# EAGLE design UserInterfaceBoard (EAGLE 5.11)

## Sheet 1 of 2
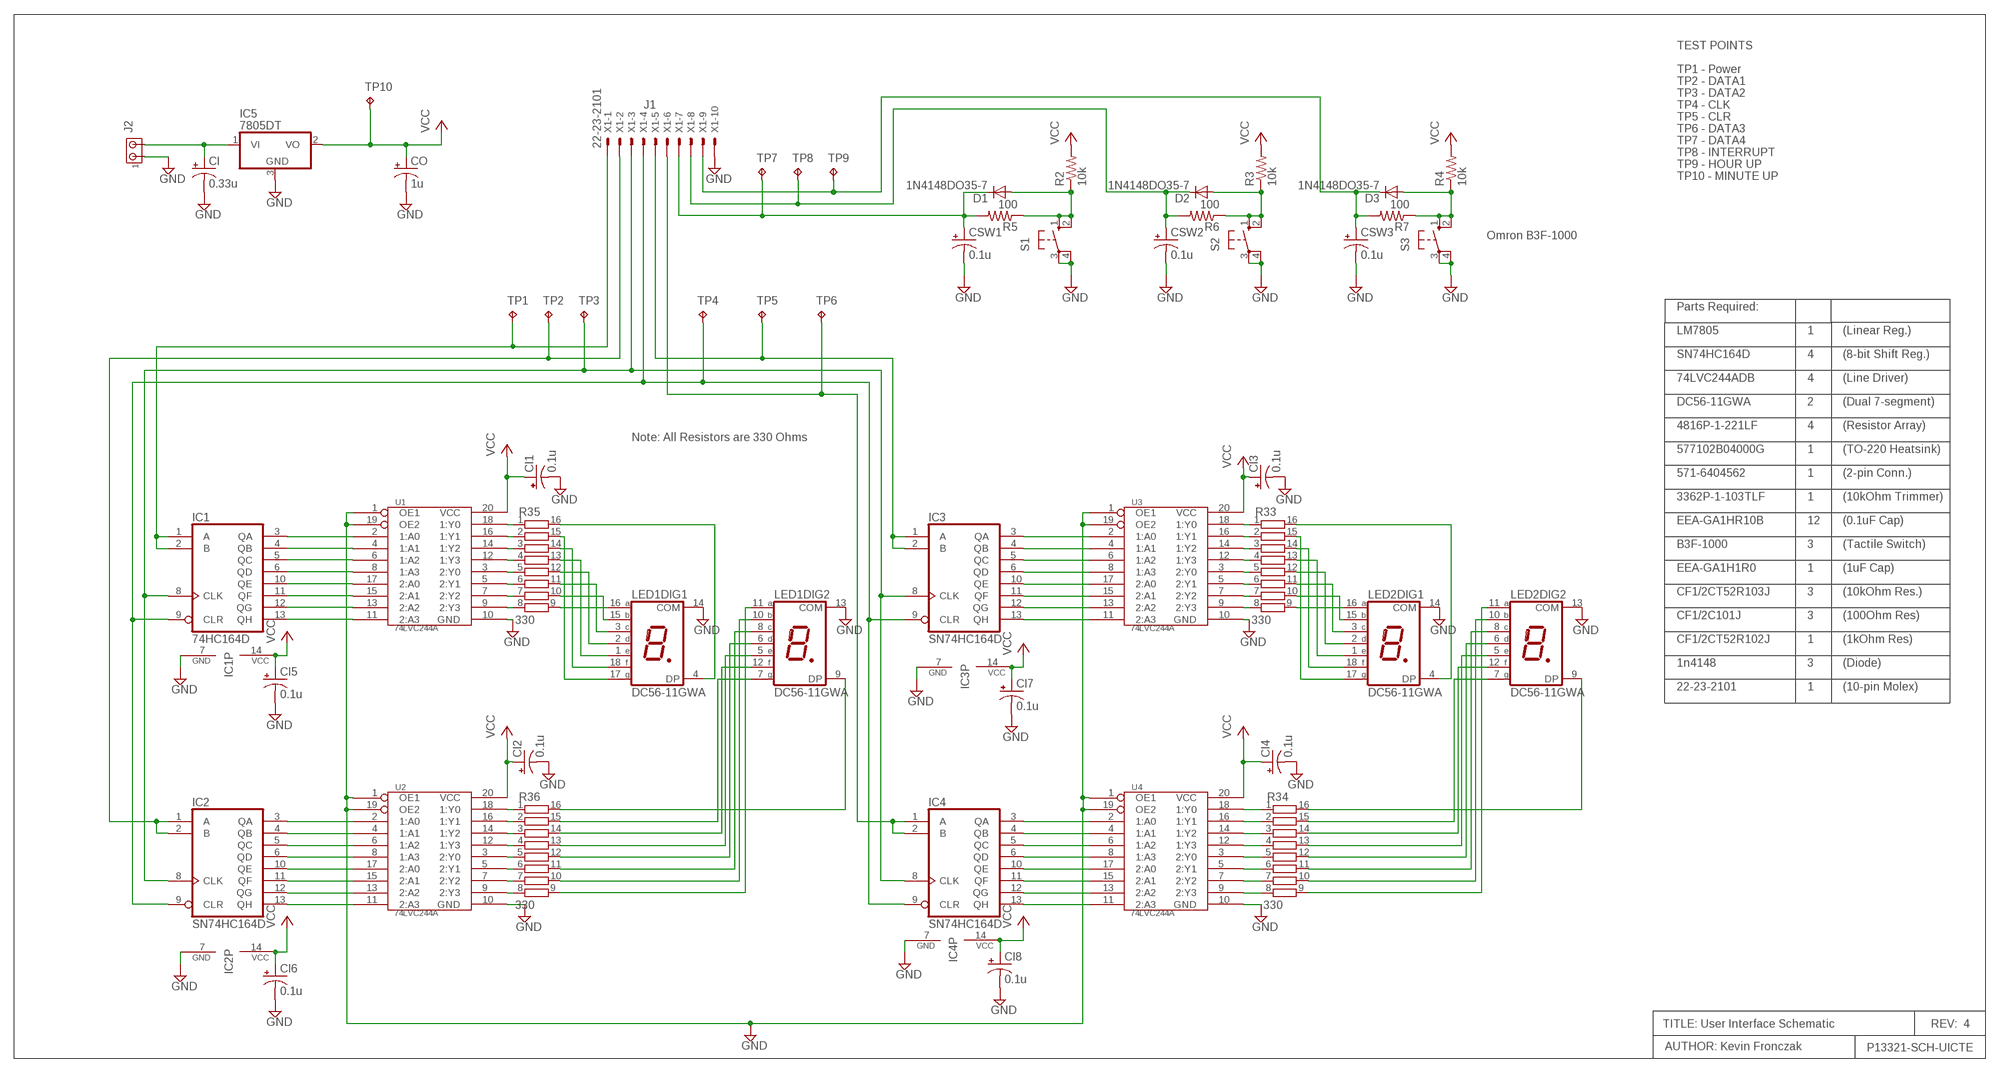
[diagram p0: schematic, sheet 1]

### Parts
CI  0.33u  CPOL-USE2-5  [E2-5]
CI1  0.1u  CPOL-USE2-5  [E2-5]
CI2  0.1u  CPOL-USE2-5  [E2-5]
CI3  0.1u  CPOL-USE2-5  [E2-5]
CI4  0.1u  CPOL-USE2-5  [E2-5]
CI5  0.1u  CPOL-USE2-5  [E2-5]
CI6  0.1u  CPOL-USE2-5  [E2-5]
CI7  0.1u  CPOL-USE2-5  [E2-5]
CI8  0.1u  CPOL-USE2-5  [E2-5]
CO  1u  CPOL-USE2-5  [E2-5]
CSW1  0.1u  CPOL-USE2-5  [E2-5]
CSW2  0.1u  CPOL-USE2-5  [E2-5]
CSW3  0.1u  CPOL-USE2-5  [E2-5]
D1  1N4148DO35-7  [DO35-7]
D2  1N4148DO35-7  [DO35-7]
D3  1N4148DO35-7  [DO35-7]
IC1  74HC164D  [SO14]
IC2  SN74HC164D  74164D  [SO14]
IC3  SN74HC164D  74164D  [SO14]
IC4  SN74HC164D  74164D  [SO14]
IC5  7805DT  [TO252]
J2  MTA02-100  [10X02MTA]
LED1  DC56-11GWA  [DA56]
LED2  DC56-11GWA  [DA56]
R2  10k  R-US_0207/10  [0207/10]
R3  10k  R-US_0207/10  [0207/10]
R4  10k  R-US_0207/10  [0207/10]
R5  100  R-US_0207/10  [0207/10]
R6  100  R-US_0207/10  [0207/10]
R7  100  R-US_0207/10  [0207/10]
R33  330  4816P-T01  [4816P]
R34  330  4816P-T01  [4816P]
R35  330  4816P-T01  [4816P]
R36  330  4816P-T01  [4816P]
S1  10-XX  [B3F-10XX]
S2  10-XX  [B3F-10XX]
S3  10-XX  [B3F-10XX]
TP1  TPPAD1-13  [P1-13]
TP2  TPPAD1-13  [P1-13]
TP3  TPPAD1-13  [P1-13]
TP4  TPPAD1-13  [P1-13]
TP5  TPPAD1-13  [P1-13]
TP6  TPPAD1-13  [P1-13]
TP7  TPPAD1-13  [P1-13]
TP8  TPPAD1-13  [P1-13]
TP9  TPPAD1-13  [P1-13]
TP10  TPPAD1-13  [P1-13]
U1  74LVC244A  [SO20W]
U2  74LVC244A  [SO20W]
U3  74LVC244A  [SO20W]
U4  74LVC244A  [SO20W]
X1  22-23-2101  [22-23-2101]

### Nets
GND: CI1.- CI2.- CI3.- CI4.- CI5.- CI6.- CI7.- CI8.- CI.- CO.- CSW1.- CSW2.- CSW3.- IC1.7(GND) IC2.7(GND) IC3.7(GND) IC4.7(GND) IC5.3(GND) LED1.13(DIG2:COM) LED1.14(DIG1:COM) LED2.13(DIG2:COM) LED2.14(DIG1:COM) S1.3(P) S1.4(P1) S2.3(P) S2.4(P1) S3.3(P) S3.4(P1) U1.1(OE1) U1.10(GND) U1.19(OE2) U2.1(OE1) U2.10(GND) U2.19(OE2) U3.1(OE1) U3.10(GND) U3.19(OE2) U4.1(OE1) U4.10(GND) U4.19(OE2) X1.10
N$1: IC1.3(QA) U1.2(1:A0)
N$2: IC1.4(QB) U1.4(1:A1)
N$3: IC1.5(QC) U1.6(1:A2)
N$4: IC1.6(QD) U1.8(1:A3)
N$5: IC1.10(QE) U1.17(2:A0)
N$6: IC1.11(QF) U1.15(2:A1)
N$7: IC1.12(QG) U1.13(2:A2)
N$8: IC1.13(QH) U1.11(2:A3)
N$9: R35.1 U1.18(1:Y0)
N$10: LED1.15(DIG1:B) R35.10
N$11: LED1.3(DIG1:C) R35.11
N$12: LED1.2(DIG1:D) R35.12
N$13: LED1.1(DIG1:E) R35.13
N$14: LED1.18(DIG1:F) R35.14
N$15: LED1.17(DIG1:G) R35.15
N$16: LED1.4(DIG1:DP) R35.16
N$17: IC2.3(QA) U2.2(1:A0)
N$18: IC2.4(QB) U2.4(1:A1)
N$19: IC2.5(QC) U2.6(1:A2)
N$20: IC2.6(QD) U2.8(1:A3)
N$21: IC2.10(QE) U2.17(2:A0)
N$22: IC2.11(QF) U2.15(2:A1)
N$23: IC2.12(QG) U2.13(2:A2)
N$24: IC2.13(QH) U2.11(2:A3)
N$26: R35.2 U1.16(1:Y1)
N$27: IC1.1(A) IC1.2(B) TP1.TP X1.1
N$28: R35.3 U1.14(1:Y2)
N$29: R35.4 U1.12(1:Y3)
N$30: R35.5 U1.3(2:Y0)
N$31: R35.6 U1.5(2:Y1)
N$32: R35.7 U1.7(2:Y2)
N$33: R35.8 U1.9(2:Y3)
N$34: LED1.16(DIG1:A) R35.9
N$35: IC1.8(CLK) IC2.8(CLK) IC3.8(CLK) IC4.8(CLK) TP3.TP X1.3
N$36: IC1.9(CLR) IC2.9(CLR) IC3.9(CLR) IC4.9(CLR) TP4.TP X1.4
N$37: LED2.15(DIG1:B) R33.10
N$38: LED2.3(DIG1:C) R33.11
N$39: LED2.2(DIG1:D) R33.12
N$40: LED2.1(DIG1:E) R33.13
N$41: LED2.18(DIG1:F) R33.14
N$42: LED2.17(DIG1:G) R33.15
N$43: R33.2 U3.16(1:Y1)
N$44: LED2.11(DIG2:A) R34.9
N$45: LED2.10(DIG2:B) R34.10
N$46: LED2.8(DIG2:C) R34.11
N$47: LED2.6(DIG2:D) R34.12
N$48: LED2.5(DIG2:E) R34.13
N$49: LED2.12(DIG2:F) R34.14
N$50: LED2.7(DIG2:G) R34.15
N$51: LED2.9(DIG2:DP) R34.16
N$52: R33.1 U3.18(1:Y0)
N$53: IC3.3(QA) U3.2(1:A0)
N$54: IC3.4(QB) U3.4(1:A1)
N$55: IC3.5(QC) U3.6(1:A2)
N$56: IC3.6(QD) U3.8(1:A3)
N$57: IC3.10(QE) U3.17(2:A0)
N$58: IC3.11(QF) U3.15(2:A1)
N$59: IC3.12(QG) U3.13(2:A2)
N$60: IC3.13(QH) U3.11(2:A3)
N$61: IC4.3(QA) U4.2(1:A0)
N$62: IC4.4(QB) U4.4(1:A1)
N$63: IC4.5(QC) U4.6(1:A2)
N$64: IC4.6(QD) U4.8(1:A3)
N$65: IC4.10(QE) U4.17(2:A0)
N$66: IC4.11(QF) U4.15(2:A1)
N$67: IC4.12(QG) U4.13(2:A2)
N$68: IC4.13(QH) U4.11(2:A3)
N$69: LED2.4(DIG1:DP) R33.16
N$70: IC3.1(A) IC3.2(B) TP5.TP X1.5
N$71: LED2.16(DIG1:A) R33.9
N$72: D1.A R2.1 R5.1 S1.1(S) S1.2(S1)
N$73: IC2.1(A) IC2.2(B) TP2.TP X1.2
N$74: IC4.1(A) IC4.2(B) TP6.TP X1.6
N$75: R33.3 U3.14(1:Y2)
N$76: R33.4 U3.12(1:Y3)
N$77: R33.5 U3.3(2:Y0)
N$78: R33.6 U3.5(2:Y1)
N$79: R33.7 U3.7(2:Y2)
N$80: R33.8 U3.9(2:Y3)
N$81: R34.2 U4.16(1:Y1)
N$82: R34.1 U4.18(1:Y0)
N$83: R34.3 U4.14(1:Y2)
N$84: R34.4 U4.12(1:Y3)
N$85: R34.5 U4.3(2:Y0)
N$86: R34.6 U4.5(2:Y1)
N$87: R34.7 U4.7(2:Y2)
N$88: R34.8 U4.9(2:Y3)
N$89: LED1.11(DIG2:A) R36.9
N$90: LED1.10(DIG2:B) R36.10
N$91: LED1.8(DIG2:C) R36.11
N$92: LED1.6(DIG2:D) R36.12
N$93: LED1.5(DIG2:E) R36.13
N$94: LED1.12(DIG2:F) R36.14
N$95: LED1.7(DIG2:G) R36.15
N$96: LED1.9(DIG2:DP) R36.16
N$97: R36.1 U2.18(1:Y0)
N$98: R36.2 U2.16(1:Y1)
N$99: R36.3 U2.14(1:Y2)
N$100: R36.4 U2.12(1:Y3)
N$101: R36.5 U2.3(2:Y0)
N$102: R36.6 U2.5(2:Y1)
N$103: R36.7 U2.7(2:Y2)
N$104: R36.8 U2.9(2:Y3)
N$105: CI.+ IC5.1(VI) J2.2
N$107: D2.A R3.1 R6.1 S2.1(S) S2.2(S1)
N$110: D3.A R4.1 R7.1 S3.1(S) S3.2(S1)
N$111: CSW1.+ D1.C R5.2 TP7.TP X1.7
N$112: CSW2.+ D2.C R6.2 TP8.TP X1.8
N$113: CSW3.+ D3.C R7.2 TP9.TP X1.9
VCC: CI1.+ CI2.+ CI3.+ CI4.+ CI5.+ CI6.+ CI7.+ CI8.+ CO.+ IC1.14(VCC) IC2.14(VCC) IC3.14(VCC) IC4.14(VCC) IC5.2(VO) R2.2 R3.2 R4.2 TP10.TP U1.20(VCC) U2.20(VCC) U3.20(VCC) U4.20(VCC)
Unconnected: J2.1

### Notes on the sheet
- TEST POINTS
- TP1 - Power
- TP2 - DATA1
- TP3 - DATA2
- J1 | TP4 - CLK
- TP5 - CLR
- TP6 - DATA3
- TP7 - DATA4
- TP8 - INTERRUPT
- TP9 - HOUR UP
- TP10 - MINUTE UP
- Omron B3F-1000
- Parts Required:
- LM7805 | 1 | (Linear Reg.)
- SN74HC164D | 4 | (8-bit Shift Reg.)
- 74LVC244ADB | 4 | (Line Driver)
- DC56-11GWA | 2 | (Dual 7-segment)
- 4816P-1-221LF | 4 | (Resistor Array)
- Note: All Resistors are 330 Ohms
- 577102B04000G | 1 | (TO-220 Heatsink)
- 571-6404562 | 1 | (2-pin Conn.)
- 3362P-1-103TLF | 1 | (10kOhm Trimmer)
- EEA-GA1HR10B | 12 | (0.1uF Cap)
- B3F-1000 | 3 | (Tactile Switch)
- EEA-GA1H1R0 | 1 | (1uF Cap)
- CF1/2CT52R103J | 3 | (10kOhm Res.)
- CF1/2C101J | 3 | (100Ohm Res)
- CF1/2CT52R102J | 1 | (1kOhm Res)
- 1n4148 | 3 | (Diode)
- 22-23-2101 | 1 | (10-pin Molex)
- TITLE: User Interface Schematic | REV:  4
- AUTHOR: Kevin Fronczak | P13321-SCH-UICTE

## Sheet 2 of 2

## Library data of the parts
CI CI1-CI8 CO CSW1-CSW3 = rcl:CPOL-US: POLARIZED CAPACITOR, American symbol
D1-D3 = diode:1N4148: DIODE high speed (Philips)
IC1-IC4 = 74xx-us:74*164: 8-bit parallel out SHIFT REGISTER
IC5 = linear:78*: Positive VOLTAGE REGULATOR Source: http://cache.national.com/ds/LM/LM78L05.pdf http://www.fairchildsemi.com/ds/LM/LM7805.pdf
J2 = con-amp:MTA02-100: AMP connector; OC_FARNELL: unknown; OC_NEWARK: unknown
LED1 LED2 = display-kingbright:DC56-11: 14.22mm (0.56INCH) DUAL DIGIT NUMERIC DISPLAYS Source: www.kingbright.com .. DA56-11SRWA.pdf; OC_FARNELL: unknown; OC_NEWARK: unknown
R2-R7 = rcl:R-US_: RESISTOR, American symbol
R33-R36 = resistor-bourns:4816P-T01: BOURNS RESISTOR NETWORK; MF: BOURNS, INC.; MPN: 4816P-T01-684LF; OC_FARNELL: 9357483; OC_NEWARK: 33K0707
S1-S3 = switch-omron:10-XX: OMRON SWITCH; MPN: B3F-1000; OC_FARNELL: 176432; OC_NEWARK: 36M3542
TP1-TP10 = testpad:TP: Test pad
U1-U4 = 74xx-us:74LVC244A: Octal buffer/line driver; 3-state; non-inverting
X1 = con-molex:22-23-2101: .100" (2.54mm) Center Header - 10 Pin; MF: MOLEX; MPN: 22-23-2101; OC_FARNELL: 1756828; OC_NEWARK: 94C0765

## Board
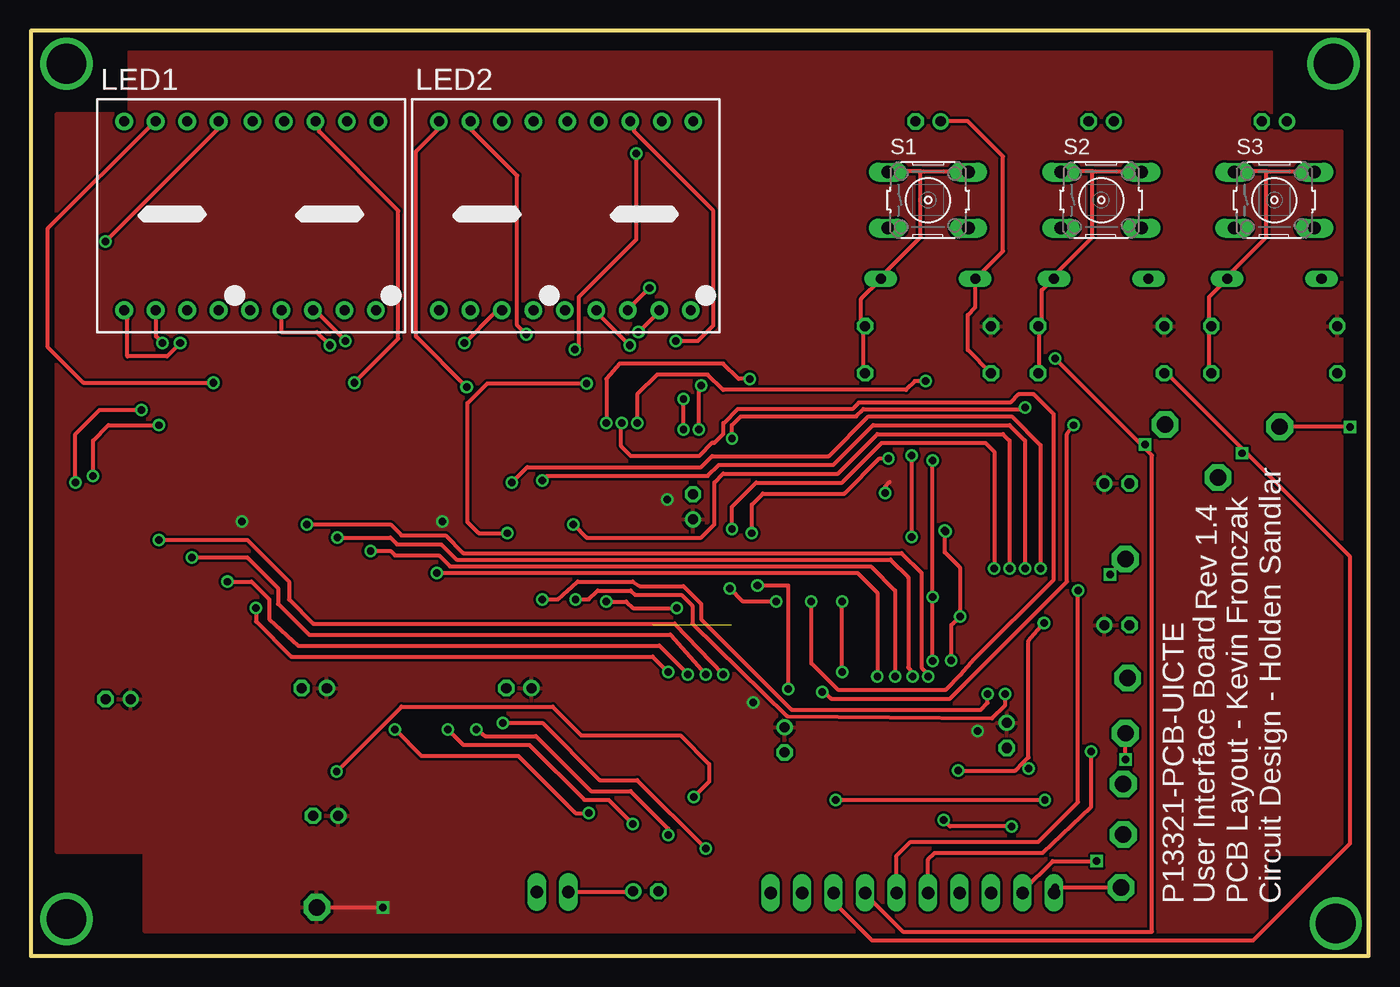
[diagram p1: board, top side]
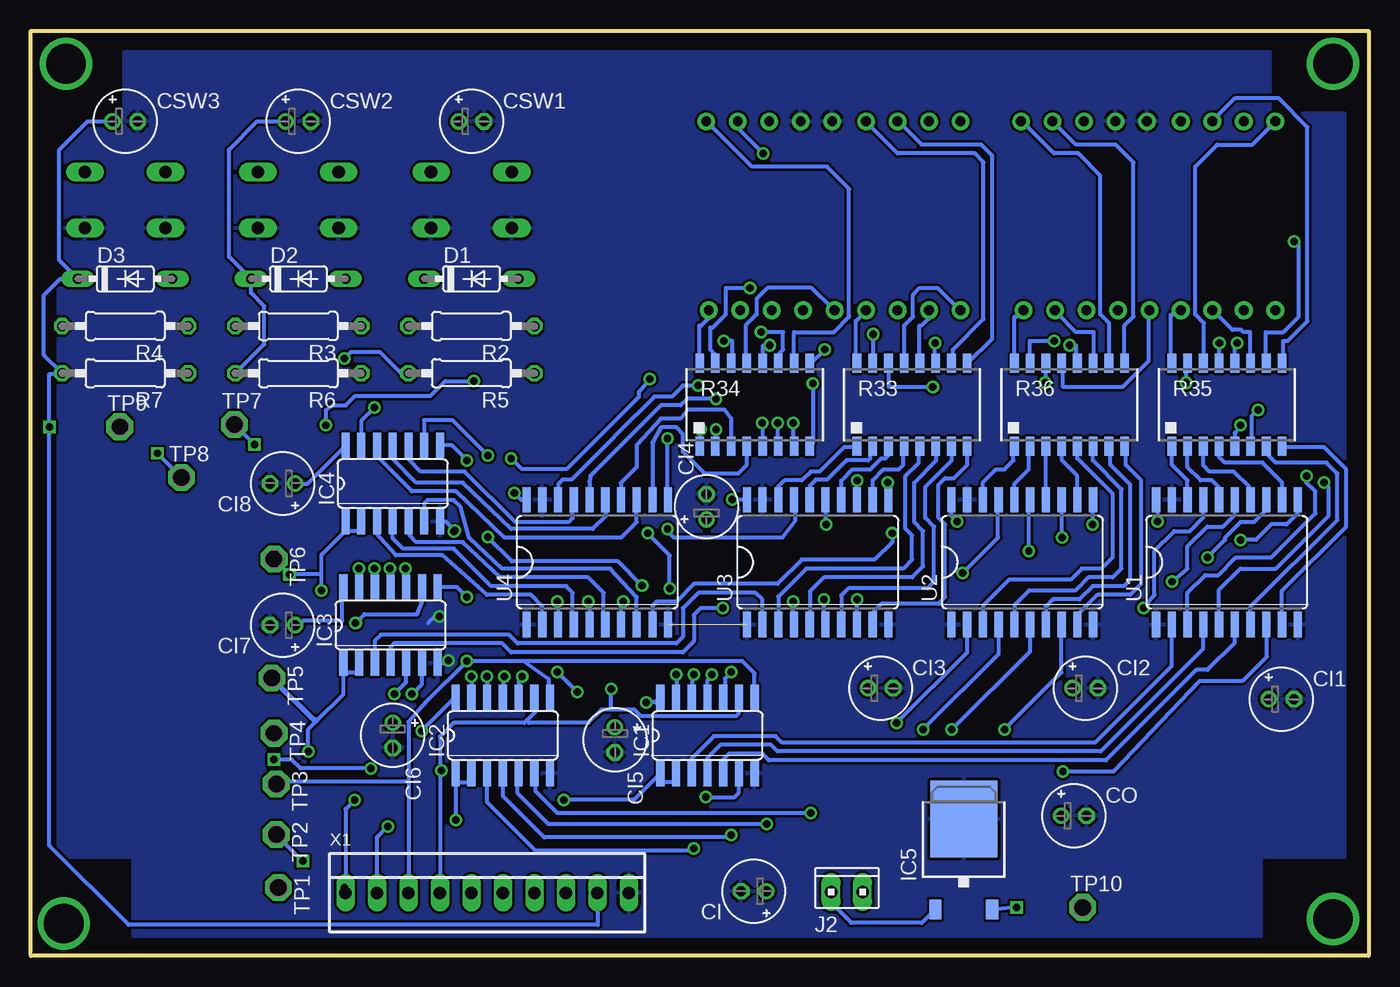
[diagram p2: board, bottom side, seen from below]

Size 107.93 x 74.6 mm. Coordinates in mm from the lower left corner, seen from the top.
Outline: 0,0 107.93,0 107.93,74.6 0,74.6 0,0
Copper layers (1*16): Top 0.035mm / dielectric 1.5mm / Bottom 0.035mm
Design rules "default *": minimum track width 12mil, minimum drill 24mil, track to track 8mil, track to pad 8mil, pad to pad 8mil, via to via 8mil, smd to smd 8mil, copper to edge 40mil, drill to drill 8mil, minimum pad ring 10mil, minimum via ring 8mil, stop-mask expansion 4mil, vias tented up to drill 0mil, thermal gap 10mil

### Footprints (pad centres in the part's own frame; a part is rotated, then mirrored left to right if it is on the bottom)
E2-5 = drill 0.813 pad 1.27 round: + -1.016,0 | drill 0.813 pad 1.27 octagon: - 1.016,0
DO35-7 = drill 0.813 long: A 3.81,0; C -3.81,0
SO14 = smd 0.66 x 2.032: 1 -3.81,-3.073; 2 -2.54,-3.073; 3 -1.27,-3.073; 4 0,-3.073; 5 1.27,-3.073; 6 2.54,-3.073; 7 3.81,-3.073; 8 3.81,3.073; 9 2.54,3.073; 10 1.27,3.073; 11 0,3.073; 12 -1.27,3.073; 13 -2.54,3.073; 14 -3.81,3.073
TO252 = smd 1 x 1.6: 1 -2.28,-4.8; 2 2.28,-4.8 | smd 5.4 x 6.2: 3 0,2.5
10X02MTA = drill 1.016 long: 1 1.27,0; 2 -1.27,0
DA56 = drill 0.8 pad 1.422 round: 1 -10.26,-7.62; 2 -7.72,-7.62; 3 -5.18,-7.62; 4 -2.64,-7.62; 5 -0.1,-7.62; 6 2.44,-7.62; 7 4.98,-7.62; 8 7.52,-7.62; 9 10.06,-7.62; 10 10.26,7.62; 11 7.72,7.62; 12 5.18,7.62; 13 2.64,7.62; 14 0.1,7.62; 15 -2.64,7.62; 16 -5.18,7.62; 17 -7.72,7.62; 18 -10.26,7.62
0207/10 = drill 0.813 octagon: 1 -5.08,0; 2 5.08,0
4816P = smd 0.7 x 1.5: 1 -4.445,-3.346; 2 -3.175,-3.346; 3 -1.905,-3.346; 4 -0.635,-3.346; 5 0.635,-3.346; 6 1.905,-3.346; 7 3.175,-3.346; 8 4.445,-3.346; 9 4.445,3.346; 10 3.175,3.346; 11 1.905,3.346; 12 0.635,3.346; 13 -0.635,3.346; 14 -1.905,3.346; 15 -3.175,3.346; 16 -4.445,3.346
B3F-10XX = drill 1.016 long: 1 -3.251,2.261; 2 3.251,2.261; 3 -3.251,-2.261; 4 3.251,-2.261
P1-13 = drill 1.321 pad 2.159 octagon: TP 0,0
SO20W = smd 0.66 x 2.032: 1 -5.715,-5.029; 2 -4.445,-5.029; 3 -3.175,-5.029; 4 -1.905,-5.029; 5 -0.635,-5.029; 6 0.635,-5.029; 7 1.905,-5.029; 8 3.175,-5.029; 9 4.445,-5.029; 10 5.715,-5.029; 11 5.715,5.029; 12 4.445,5.029; 13 3.175,5.029; 14 1.905,5.029; 15 0.635,5.029; 16 -0.635,5.029; 17 -1.905,5.029; 18 -3.175,5.029; 19 -4.445,5.029; 20 -5.715,5.029
22-23-2101 = drill 1 long: 1 -11.43,0; 2 -8.89,0; 3 -6.35,0; 4 -3.81,0; 5 -1.27,0; 6 1.27,0; 7 3.81,0; 8 6.35,0; 9 8.89,0; 10 11.43,0

### Placement (x,y rotation side)
CI  49.61,5.21 180 bottom
CI1  7.04,20.7 0 bottom
CI2  22.86,21.59 0 bottom
CI3  39.37,21.59 0 bottom
CI4  53.42,36.22 90 bottom
CI5  60.81,17.42 270 bottom
CI6  78.74,17.78 270 bottom
CI7  87.63,26.67 180 bottom
CI8  87.63,38.1 180 bottom
CO  23.77,11.3 0 bottom
CSW1  72.39,67.31 0 bottom
CSW2  86.36,67.31 0 bottom
CSW3  100.33,67.31 0 bottom
D1  72.39,54.61 0 bottom
D2  86.36,54.61 0 bottom
D3  100.33,54.61 0 bottom
IC1  53.34,17.78 0 bottom
IC2  69.85,17.78 0 bottom
IC3  78.92,26.67 0 bottom
IC4  78.74,38.1 0 bottom
IC5  32.66,8.53 0 bottom
J2  42.09,5.16 0 bottom
LED1  17.78,59.69 0 top
LED2  43.18,59.69 0 top
R2  72.39,50.8 180 bottom
R3  86.36,50.8 180 bottom
R4  100.33,50.8 180 bottom
R5  72.39,46.99 180 bottom
R6  86.36,46.99 180 bottom
R7  100.33,46.99 180 bottom
R33  36.83,44.45 0 bottom
R34  49.53,44.45 0 bottom
R35  11.43,44.45 0 bottom
R36  24.13,44.45 0 bottom
S1  72.39,60.96 0 top
S2  86.36,60.96 0 top
S3  100.33,60.96 0 top
TP1  87.96,5.51 270 bottom
TP2  88.14,9.78 270 bottom
TP3  88.14,13.87 270 bottom
TP4  88.32,17.96 270 bottom
TP5  88.49,22.4 270 bottom
TP6  88.32,32 270 bottom
TP7  91.52,42.85 0 bottom
TP8  95.78,38.58 0 bottom
TP9  100.76,42.67 0 bottom
TP10  23.06,3.91 0 bottom
U1  11.43,31.75 0 bottom
U2  27.94,31.75 0 bottom
U3  44.45,31.75 0 bottom
U4  62.23,31.75 0 bottom
X1  71.12,5.08 0 bottom

### Tracks (layer width: path | path; a pad name or v marks a point on that pad's centre or on a via)
GND  (via drill 0.6)  (1 unrouted)
  Top 0.305: v73.74,34.31 73.74,32.54 74.98,31.29 v74.98,27.38 74.27,26.67 v74.27,23.82
  Bottom 0.305: IC2.7 66.17,14.71 | IC4.7 74.45,35.03 v73.74,34.31 | v74.98,27.38 75.34,27.38 75.87,26.85 | IC3.7 74.5,23.6 v74.27,23.82
  pour Bottom: 1.91,67.92 7.95,67.92 7.95,72.9 100.41,72.9 100.41,66.67 105.74,66.67 105.74,8 99.87,8 99.7,8 99.7,1.6 8.66,1.6 8.66,8 1.91,8 1.91,8.53
N$1
  Bottom 0.305: IC1.3 54.61,15.95 52.83,17.73 47.85,17.73 47.32,17.2 22.07,17.2 15.88,23.39 U1.2
N$2
  Bottom 0.305: U1.4 13.34,24.77 21.62,16.48 47.68,16.48 48.21,17.02 52.3,17.02 53.34,15.98 IC1.4
N$3
  Bottom 0.305: IC1.5 52.07,15.82 51.59,16.31 48.92,16.31 48.39,15.77 21.18,15.77 13.89,23.06 13.01,23.06 10.8,25.27 U1.6
N$4  (via drill 0.6)
  Top 0.305: v53.47,12.8 54.71,14.05 54.71,15.47 52.4,17.78 44.4,17.78 42.09,20.09 29.9,20.09 v24.66,14.86
  Bottom 0.305: U1.8 8.2,26.67 8.2,24.13 10.19,22.15 13.64,22.15 20.57,14.86 v24.66,14.86 | IC1.6 50.8,13.16 51.16,12.8 v53.47,12.8
N$5  (via drill 0.6 pad 0.25)
  Top 0.305: v51.41,22.89 50.17,24.13 21.01,24.13 18.16,26.98 v18.16,28.04
  Bottom 0.305: 51.94,21.08 IC1.10 51.94,20.98 51.94,22.35 v51.41,22.89 | v18.16,28.04 17.27,29.11 17.27,32.66 15.67,34.27 14.43,34.27 13.34,35.36 U1.17
N$6  (via drill 0.6 pad 0.25)
  Top 0.305: v53.01,22.71 50.7,25.02 21.54,25.02 19.23,27.15 19.23,28.75 17.81,30.18 v15.85,30.18
  Bottom 0.305: v15.85,30.18 14.61,31.24 14.61,33.02 13.01,34.62 11.76,34.62 10.8,35.59 U1.15 | v53.01,22.71 53.01,22.53 53.37,22.17 53.37,20.88 IC1.11
N$7  (via drill 0.6 pad 0.25)
  Top 0.305: v54.43,22.71 51.59,25.91 22.43,25.91 19.94,28.4 19.94,29.64 17.45,32.13 v13.01,32.13
  Bottom 0.305: v13.01,32.13 11.58,33.55 11.58,33.73 10.34,34.98 9.27,34.98 8.26,35.99 U1.13 | v54.43,22.71 54.61,22.53 IC1.12
N$8  (via drill 0.6 pad 0.25)
  Top 0.305: v55.85,22.71 51.94,26.8 22.78,26.8 20.83,28.75 20.83,30.18 17.45,33.55 v10.34,33.55
  Bottom 0.305: v10.34,33.55 9.09,33.55 7.85,34.8 6.6,34.8 5.72,35.69 U1.11 | v55.85,22.71 55.85,20.88 IC1.13
N$9
  Bottom 0.305: U1.18 14.61,38.35 15.88,39.62 R35.1
N$10  (via drill 0.61)
  Top 0.305: v5.99,57.61 15.24,66.85 15.24,67.21 LED1.15
  Bottom 0.305: v5.99,57.61 5.64,57.61 5.64,51.56 6.88,50.32 8.31,50.32 8.31,47.83 R35.10
N$11
  Bottom 0.305: R35.11 9.55,47.83 9.55,50.32 10.08,50.32 10.26,50.49 10.97,50.49 12.4,51.92 12.57,51.92 LED1.3
N$12  (via drill 0.61)
  Top 0.305: v10.62,49.43 10.08,49.96 10.08,51.92 LED1.2
  Bottom 0.305: v10.62,49.43 10.8,49.43 R35.12
N$13  (via drill 0.61)
  Top 0.305: v12.04,49.43 10.97,48.36 7.77,48.36 7.77,51.38 7.59,51.56 7.59,51.92 LED1.1
  Bottom 0.305: v12.04,49.43 12.04,47.83 R35.13
N$14
  Bottom 0.305: R35.14 13.28,47.83 13.28,51.03 14,51.74 14,63.65 12.22,65.43 9.37,65.43 7.59,67.21 LED1.18
N$15  (via drill 0.61)
  Top 0.305: LED1.17 9.91,67.21 1.37,58.67 1.37,49.07 4.22,46.23 v14.71,46.23
  Bottom 0.305: v14.71,46.23 14.71,47.65 R35.15
N$16
  Bottom 0.305: R35.16 15.95,47.83 15.95,51.74 15.77,51.74 15.6,51.92 15.24,51.92 LED1.4
N$17  (via drill 0.6, 0.6 pad 0.25)
  Top 0.305: v54.43,8.66 48.92,14.17 45.9,14.17 41.28,18.8 v38.07,18.8
  Bottom 0.305: IC2.3 71.12,12.37 67.23,8.48 54.61,8.48 v54.43,8.66 | v38.07,18.8 32.39,24.49 U2.2
N$18  (via drill 0.6, 0.6 pad 0.25)
  Top 0.305: v51.41,9.73 51.41,10.26 48.39,13.28 45.19,13.28 40.74,17.73 36.65,17.73 v35.94,18.26
  Bottom 0.305: v51.41,9.73 51.59,9.55 66.52,9.55 69.85,12.88 IC2.4 | v35.94,18.26 29.85,24.36 U2.4
N$19  (via drill 0.6, 0.6 pad 0.25)
  Top 0.305: v48.57,10.62 46.61,12.57 44.65,12.57 40.21,17.02 34.87,17.02 33.81,18.09 33.81,18.26 v33.63,18.26
  Bottom 0.305: IC2.5 68.66,14.63 68.66,13.11 66.17,10.62 v48.57,10.62 | v33.63,18.26 27.31,24.59 U2.6
N$20  (via drill 0.6, 0.6 pad 0.25)
  Top 0.305: v45.01,11.51 43.94,11.51 39.32,16.13 31.5,16.13 v29.36,18.26
  Bottom 0.305: IC2.6 67.23,13.28 65.46,11.51 v45.01,11.51 | v29.36,18.26 24.77,22.86 U2.8
N$21  (via drill 0.6)
  Top 0.305: v32.74,30.89 66.7,30.89 68.3,29.29 v68.3,22.53
  Bottom 0.305: IC2.10 68.58,22.25 v68.3,22.53 | v32.74,30.89 29.9,33.73 29.9,36.73 U2.17
N$22  (via drill 0.6)
  Top 0.305: v69.72,22.53 69.72,29.46 67.77,31.42 33.81,31.42 32.92,32.31 29.36,32.31 29.01,32.66 v27.41,32.66
  Bottom 0.305: IC2.11 69.85,22.4 v69.72,22.53 | v27.41,32.66 27.41,36.68 U2.15
N$23  (via drill 0.6)
  Top 0.305: v71.15,22.53 71.15,22.89 70.79,23.24 70.79,30.53 69.37,31.95 34.34,31.95 33.1,33.2 29.54,33.2 29.01,33.73 v24.74,33.73
  Bottom 0.305: IC2.12 71.12,22.5 v71.15,22.53 | v24.74,33.73 24.74,36.75 U2.13
N$24  (via drill 0.6)
  Top 0.305: v72.39,22.53 72.39,22.71 71.86,23.24 71.86,30.89 70.26,32.49 34.87,32.49 33.45,33.91 29.9,33.91 29.01,34.8 v22.25,34.8
  Bottom 0.305: v72.39,22.53 IC2.13 | v22.25,34.8 22.25,36.75 U2.11
N$25  (via drill 0.6)
  other vias: 51.41,9.73
N$26
  Bottom 0.305: U1.16 12.12,36.83 12.12,37.82 12.65,38.35 13.54,38.35 14.61,39.42 R35.2
N$27  (via drill 0.6)
  Top 0.305: v64.92,12.57 v81.81,12.57 | v82.63,5.51 TP1.TP
  Bottom 0.305: 55.88,15.24 IC1.2 55.85,14.68 55.85,13.99 57.1,13.99 57.15,14.05 IC1.1 59.28,12.57 v64.92,12.57 | v81.81,12.57 82.55,11.84 X1.1 v82.63,5.51
N$28
  Bottom 0.305: U1.14 9.63,36.88 9.63,37.82 10.87,39.06 12.83,39.06 13.34,39.57 R35.3
N$29
  Bottom 0.305: U1.12 6.96,36.8 6.96,38.18 8.56,39.78 11.58,39.78 12.07,40.26 R35.4
N$30  (via drill 0.6 pad 0.25)
  Top 0.305: v5,38.71 5,41.55 6.25,42.8 v10.34,42.8
  Bottom 0.305: U1.3 14.61,29.29 13.18,30.71 12.12,30.71 10.69,32.13 7.85,32.13 4.29,35.69 4.29,37.47 5,38.18 v5,38.71 | v10.34,42.8 10.69,42.27 10.8,42.19 R35.5
N$31  (via drill 0.6 pad 0.25)
  Top 0.305: v3.58,38.18 3.58,42.09 5.54,44.04 v8.92,44.04
  Bottom 0.305: U1.5 12.07,29.52 10.34,31.24 7.49,31.24 3.23,35.51 3.23,37.82 v3.58,38.18 | v8.92,44.04 9.45,43.51 9.45,41.2 | 9.45,41.2 9.45,41.18 R35.6 9.53,41.27 | 9.53,41.27 9.63,41.38 | 9.45,41.2 9.53,41.27
N$32
  Bottom 0.305: U1.7 9.53,28.14 2.51,35.15 2.51,38.89 3.4,39.78 7.49,39.78 8.26,40.54 R35.7
N$33
  Bottom 0.305: U1.9 6.99,29.44 1.8,34.62 1.8,39.24 3.58,41.02 6.9,41.02 R35.8
N$34
  Bottom 0.305: R35.9 6.88,47.83 6.88,49.61 6.53,49.61 4.93,51.21 4.93,66.85 7.24,69.16 10.8,69.16 12.57,67.39 LED1.16
N$35  (via drill 0.6)
  Top 0.305: v72.75,23.77 v72.75,28.93 v72.75,39.95 | v87.96,14.05 TP3.TP
  Bottom 0.305: 77.47,14.05 77.47,18.87 76.12,20.4 v72.75,23.77 68.12,23.77 | 77.47,14.05 X1.3 | 68.12,23.77 66.17,22.35 66.17,20.98 IC2.8 | IC1.8 49.53,22.78 50.52,23.77 68.12,23.77 | IC3.8 73.56,29.74 v72.75,28.93 | IC4.8 73.97,41.17 v72.75,39.95 | 77.47,14.05 v87.96,14.05
N$36  (via drill 0.6, 0.61)
  Top 0.305: v81.74,26.85 80.49,25.43 80.49,16 80.05,15.56 | 80.05,15.56 79.43,14.94 v74.8,14.94 | v71.07,33.78 v71.07,40.36 | v58.62,29.87 61.11,29.87 v61.11,21.51 | v88.32,15.82 TP4.TP | 80.05,15.56 v80.49,15.11
  Bottom 0.305: 74.93,14.94 74.93,17.68 73.81,18.8 68.12,18.8 67.95,18.97 | 74.93,14.94 X1.4 | 67.95,18.97 67.23,19.68 67.23,20.78 IC2.9 | IC1.9 50.8,19.58 51.05,19.33 58.7,19.33 59.23,19.86 61.11,19.86 | 61.11,19.86 61.9,19.86 62.97,18.8 67.77,18.8 67.95,18.97 | IC3.9 76.4,29.69 76.4,28.45 76.76,27.56 81.03,27.56 v81.74,26.85 | 74.93,14.94 v74.8,14.94 | v71.07,40.36 73.91,43.2 76.23,43.2 76.23,41.25 IC4.9 | v71.07,33.78 69.11,31.83 60.58,31.83 v58.62,29.87 | 61.11,19.86 v61.11,21.51 | v88.32,15.82 86.89,15.82 86.18,15.11 v80.49,15.11
N$37
  Bottom 0.305: R33.10 33.55,47.83 33.55,48.9 31.06,51.38 31.06,64.01 31.78,64.72 38,64.72 40.49,67.21 LED2.15
N$38  (via drill 0.61)
  Top 0.305: v34.98,49.43 37.47,51.92 38,51.92 LED2.3
  Bottom 0.305: v34.98,49.43 34.98,47.83 R33.11
N$39
  Bottom 0.305: R33.12 36.22,47.83 36.22,50.85 36.04,50.85 35.51,51.38 35.51,51.92 LED2.2
N$40
  Bottom 0.305: R33.13 37.47,50.85 36.75,51.56 36.75,53.34 36.22,53.87 34.8,53.87 33.02,52.09 LED2.1
N$41  (via drill 0.61)
  Top 0.305: v35.15,45.87 31.06,49.96 31.06,64.9 33.02,66.85 33.02,67.21 LED2.18
  Bottom 0.305: v35.15,45.87 38.71,45.87 38.71,47.65 R33.14
N$42  (via drill 0.61)
  Top 0.305: v39.95,50.14 39.24,50.85 39.24,62.94 35.33,66.85 35.33,67.21 LED2.17
  Bottom 0.305: v39.95,50.14 39.95,47.83 R33.15
N$43
  Bottom 0.305: U3.16 45.09,37.92 44.6,38.41 43.69,38.41 42.16,39.93 42.16,39.95 40.39,39.95 40.21,40.13 40.21,40.9 R33.2
N$44  (via drill 0.61)
  Top 0.305: v43.87,48.9 44.22,49.25 44.22,53.16 48.84,57.78 v48.84,64.72
  Bottom 0.305: v43.87,48.9 44.93,47.83 R34.9 | v48.84,64.72 50.8,66.67 50.8,67.21 LED2.11
N$45
  Bottom 0.305: R34.10 46.36,50.32 43.15,50.32 41.91,51.56 41.91,61.87 43.69,63.65 49.73,63.65 53.29,67.21 LED2.10
N$46  (via drill 0.61)
  Top 0.305: v49.02,50.32 50.62,51.92 LED2.8
  Bottom 0.305: v49.02,50.32 47.24,50.32 47.24,48.9 47.6,48.54 47.6,47.83 R34.11
N$47  (via drill 0.61)
  Top 0.305: v48.31,49.25 45.64,51.92 LED2.6
  Bottom 0.305: v48.31,49.25 48.84,49.25 48.84,47.83 R34.12
N$48
  Bottom 0.305: R34.13 50.27,47.83 50.27,50.85 49.38,51.74 49.38,52.98 48.49,53.87 44.93,53.87 43.15,52.09 LED2.5
N$49  (via drill 0.61)
  Top 0.305: LED2.12 48.49,67.21 48.49,66.85 48.67,66.67 48.67,66.5 55.07,60.1 55.07,50.85 53.82,49.61 v52.04,49.61
  Bottom 0.305: v52.04,49.61 51.33,49.61 51.33,47.83 R34.14
N$50  (via drill 0.61)
  Top 0.305: v49.91,53.87 48.31,52.27 48.31,52.09 LED2.7
  Bottom 0.305: v49.91,53.87 51.87,53.87 51.87,51.74 52.93,50.67 53.11,50.67 53.11,48.9 52.76,48.54 52.76,47.83 R34.15
N$51
  Bottom 0.305: R34.16 54,47.83 54,50.85 53.82,50.85 53.29,51.38 53.29,51.92 LED2.9
N$52
  Bottom 0.305: U3.18 47.63,37.87 47.14,38.35 45.72,38.35 45.01,39.06 44.3,39.06 42.34,41.02 41.36,41.02 R33.1
N$53
  Bottom 0.305: IC3.3 80.19,25.4 79.68,25.91 69.37,25.91 68.66,25.2 55.85,25.2 55.32,25.73 55.32,28.04 54.08,29.29 49.45,29.29 48.92,28.75 48.92,26.75 U3.2
N$54  (via drill 0.6)
  Top 0.305: v52.12,28.04 48.57,28.04 48.03,28.57 v46.43,28.57
  Bottom 0.305: IC3.4 78.92,24.89 78.61,25.2 69.9,25.2 69.19,24.49 55.32,24.49 54.43,25.38 54.43,27.51 53.9,28.04 v52.12,28.04 | v46.43,28.57 46.43,26.8 U3.4
N$55  (via drill 0.6)
  Top 0.305: v78.61,21.11 78.61,20.22 77.55,19.15 61.01,19.33 53.37,26.8 53.37,28.22 52.48,29.11 48.74,29.11 48.39,29.46 45.72,29.46 45.01,28.75 v43.94,28.75
  Bottom 0.305: IC3.5 77.65,22.07 v78.61,21.11 | v43.94,28.75 43.94,26.85 U3.6
N$56  (via drill 0.6)
  Top 0.305: v77.19,21.11 77.19,20.4 76.66,19.86 61.37,19.86 54.08,27.15 54.08,28.4 52.65,29.82 49.1,29.82 48.57,30.18 44.12,30.18 42.52,28.75 v41.28,28.75
  Bottom 0.305: IC3.6 76.38,21.92 v77.19,21.11 | U3.8 v41.28,28.75
N$57  (via drill 0.6)
  Top 0.305: v77.72,31.24 77.72,40.66 77.01,41.38 68.66,41.38 65.46,38.18 58.52,38.18 56.57,36.22 v56.57,34.44
  Bottom 0.305: IC3.10 77.65,31.17 v77.72,31.24 | v56.57,34.44 56.57,34.27 56.03,33.73 47.32,33.73 46.25,35.15 46.25,36.68 U3.17
N$58  (via drill 0.6)
  Top 0.305: v78.97,31.24 78.97,41.55 78.44,42.09 68.3,42.09 65.1,38.89 55.85,38.89 55.14,38.18 55.14,34.8 54.08,33.73 44.83,33.73 v43.76,34.8
  Bottom 0.305: IC3.11 78.92,31.19 v78.97,31.24 | v43.76,34.8 43.76,36.73 U3.15
N$59  (via drill 0.6)
  Top 0.305: v80.21,31.24 80.21,41.55 78.97,42.8 67.95,42.8 64.74,39.6 55.5,39.6 54.61,38.71 41.63,38.71 v41.28,38.35
  Bottom 0.305: IC3.12 80.19,31.22 v80.21,31.24 | U3.13 v41.28,38.35
N$60  (via drill 0.6)
  Top 0.305: v81.46,31.24 81.46,41.2 79.15,43.51 67.59,43.51 64.39,40.31 54.97,40.31 54.08,39.42 40.03,39.42 v38.79,38.18
  Bottom 0.305: v81.46,31.24 IC3.13 | v38.79,38.18 38.79,36.83 U3.11
N$61
  Bottom 0.305: U4.2 66.68,28.19 67.59,29.11 71.15,29.11 74.7,32.31 78.49,32.31 80.14,34.14 80.14,34.9 IC4.3 79.86,34.87
N$62
  Bottom 0.305: IC4.4 78.74,33.68 77.9,32.84 73.81,32.84 70.79,29.82 64.74,29.82 64.21,29.29 64.21,26.8 U4.4
N$63
  Bottom 0.305: IC4.5 77.42,35.03 77.37,34.98 77.37,33.91 76.84,33.38 73.1,33.38 70.08,30.53 62.97,30.53 61.72,29.29 61.72,26.85 U4.6
N$64
  Bottom 0.305: IC4.6 76.2,36.5 75.95,36.75 73.81,36.75 73.28,36.22 72.57,33.73 69.9,31.24 61.19,31.24 59.06,28.93 U4.8
N$65
  Bottom 0.305: IC4.10 77.47,40.06 76.48,39.06 72.92,39.06 68.83,34.98 64.57,34.98 64.21,35.33 64.21,36.7 U4.17
N$66
  Bottom 0.305: IC4.11 78.74,40.08 76.84,38.18 73.1,38.18 69.19,34.44 62.61,34.44 61.54,35.51 61.54,36.73 U4.15
N$67
  Bottom 0.305: IC4.12 80.01,40.28 77.19,37.47 73.63,37.47 69.72,33.73 60.3,33.73 59.06,34.98 U4.13
N$68  (via drill 0.6)
  Top 0.305: v56.57,41.73 56.57,42.8 57.28,43.51 66.57,43.51 67.16,44.09 80.09,44.09 v80.21,44.22
  Bottom 0.305: IC4.13 81.28,43.16 v80.21,44.22 | v56.57,41.73 56.57,36.83 U4.11
N$69
  Bottom 0.305: R33.16 41.38,47.83 41.38,51.21 40.67,51.92 LED2.4
N$70  (via drill 0.6)
  Top 0.305: X1.5 72.39,7.77 72.92,8.31 81.64,8.31 85.55,12.04 v85.55,16.48
  Bottom 0.305: v85.55,16.48 85.55,18.26 84.86,18.95 | 84.86,18.95 82.7,21.11 82.7,22.89 | 82.7,22.89 82.7,23.27 IC3.1 82.73,22.91 82.7,22.89 | 82.7,22.89 81.46,22.89 IC3.2 | 84.86,18.95 84.94,19.02
  Bottom 0.406: 84.94,19.02 85.12,19.02 TP5.TP
N$71
  Bottom 0.305: R33.9 32.31,47.83 30.35,49.78 30.35,64.54 31.24,65.43 36.04,65.43 37.82,67.21 38,67.21 LED2.16
N$72
  Top 0.305: 71.78,63.3 75.51,63.3 S1.2 | 71.78,63.3 69.29,63.3 S1.1 | R5.1 67.16,47.12 67.16,50.67 R2.1 66.98,50.67 66.98,52.98 68.58,54.59 D1.A 68.58,54.76 71.78,57.96 71.78,63.3
N$73  (via drill 0.6)
  Top 0.305: v79.15,10.44 74.17,10.44 v73.63,10.97 | v86,7.64 82.45,7.64 80.14,5.33 80.14,5.16 X1.2
  Bottom 0.305: X1.2 80.01,9.58 v79.15,10.44 | v73.63,10.97 73.63,13.99 | 73.63,13.99 73.63,14.68 IC2.1 73.66,14.02 73.63,13.99 | 73.63,13.99 72.39,13.99 IC2.2 | v86,7.64 TP2.TP
N$74  (via drill 0.6)
  Top 0.305: X1.6 69.85,8.08 70.97,9.2 81.28,9.2 84.48,12.39 v84.48,29.46 | v87.07,30.76 TP6.TP
  Bottom 0.305: 82.55,34.29 IC4.1 82.55,35.56 | 82.55,34.29 81.28,34.29 IC4.2 | v84.48,29.46 84.48,30.76 | 84.48,30.76 84.48,32.36 82.55,34.29 | 84.48,30.76 v87.07,30.76
N$75
  Bottom 0.305: U3.14 42.55,38.33 41.63,39.24 40.21,39.24 39.32,40.13 38.96,40.13 38.61,40.49 38.61,40.98 R33.3
N$76
  Bottom 0.305: U3.12 40.01,38.38 39.14,39.24 37.9,39.24 37.54,39.6 37.54,41.03 R33.4
N$77
  Bottom 0.305: U3.3 47.63,28.98 45.36,31.24 37.54,31.24 36.83,31.95 36.83,33.91 37.36,34.44 37.36,38.71 36.3,39.78 36.3,41 R33.5
N$78
  Bottom 0.305: U3.5 45.09,29.39 43.94,30.53 36.83,30.53 35.94,31.42 35.94,34.27 36.65,34.98 36.65,38.18 34.87,39.95 34.87,41.05 R33.6
N$79
  Bottom 0.305: U3.7 42.55,29.08 41.99,29.64 35.59,29.64 35.05,30.18 35.05,34.62 35.76,35.33 35.76,37.82 33.63,39.95 33.63,41.08 R33.7
N$80
  Bottom 0.305: U3.9 40.01,27.71 39.32,28.4 34.7,28.4 34.16,28.93 34.16,34.8 34.7,35.33 34.7,38 34.16,38.53 33.45,38.53 32.39,39.6 R33.8
N$81  (via drill 0.6)
  Top 0.305: v52.65,42.44 v52.65,44.93
  Bottom 0.305: U4.16 62.87,38.28 62.79,38.71 57.1,44.4 55.5,44.4 54.97,44.93 v52.65,44.93 | v52.65,42.44 52.65,41.16 R34.2
N$82  (via drill 0.6)
  Top 0.305: v54.08,46 54.08,45.64 53.9,45.47 v53.9,42.44
  Bottom 0.305: v54.08,46 55.32,46 56.21,45.11 57.63,45.11 60.6,42.14 61.14,41.58 64.31,38.41 65.02,38.41 65.38,38.05 65.38,36.8 U4.18 | v53.9,42.44 53.9,41.18 R34.1
N$83
  Bottom 0.305: U4.14 60.33,38.15 59.06,39.42 59.06,41.2 57.1,43.33 55.5,43.33 54.97,44.04 51.94,44.04 51.41,43.33 51.41,41.13 R34.3
N$84
  Bottom 0.305: U4.12 57.79,41.4 57.1,42.62 55.85,42.62 55.32,42.09 55.32,40.66 53.54,38.89 50.88,38.89 50.17,39.6 R34.4
N$85  (via drill 0.6)
  Top 0.305: v65.46,22.89 v65.46,28.57 | v63.86,21.29 64.03,21.29 64.57,20.75 74.17,20.75 83.59,30.18 83.59,42.09 v84.13,42.8 | v72.21,46.35 71.32,46.35 70.61,45.64 55.85,45.64 54.61,46.89 50.52,46.89 48.92,45.29 v48.92,42.98
  Bottom 0.305: U4.3 65.41,28.7 65.46,28.75 v65.46,28.57 | v63.86,21.29 v65.46,22.89 | v84.13,42.8 84.13,44.04 83.59,44.4 82.52,44.4 81.76,45.16 75.69,45.16 74.5,46.35 v72.21,46.35 | v48.92,42.98 48.92,41.13 R34.5
N$86  (via drill 0.6)
  Top 0.305: v62.97,28.57 62.97,23.6 65.1,21.46 73.81,21.46 75.06,22.71 76.12,23.95 82.52,30.35 82.52,43.69 80.92,45.29 79.68,45.29 79.02,44.63 66.8,44.63 66.27,44.09 57.02,44.09 55.91,42.98 55.85,42.98 55.85,42.09 55.14,41.38 54.97,41.38 53.9,40.31 48.42,40.31 R34.6 47.63,42.93 v47.68,42.98
  Bottom 0.305: U4.5 62.87,28.47 v62.97,28.57 | v47.68,42.98 47.68,41.16 R34.6
N$87  (via drill 0.6)
  Top 0.305: v60.12,28.57 57.46,28.57 v56.39,29.64 | v58.17,34.09 58.17,36.4 59.06,37.29 65.63,37.29 68.48,40.13 v69.19,40.13 | v57.99,46.53 57.1,46.53 55.85,47.78 47.5,47.78 46.43,46.53 v46.43,42.98
  Bottom 0.305: U4.7 60.33,28.37 v60.12,28.57 | v56.39,29.64 56.39,32.31 v58.17,34.09 | 69.37,40.13 v69.19,40.13 68.35,39.29 64.67,39.29 58.88,45.09 58.88,45.47 v57.99,46.53 | v46.43,42.98 46.43,41.18 R34.7
N$88  (via drill 0.6)
  Top 0.305: v38.43,34.09 36.12,34.09 35.23,34.98 35.23,44.58 36.83,46.18 v44.83,46.18
  Bottom 0.305: U4.9 57.79,28.25 57.46,28.57 55.85,28.57 54.43,30 47.68,30 45.72,31.95 39.85,31.95 38.43,33.38 v38.43,34.09 | v44.83,46.18 44.83,41.36 R34.8
N$89
  Bottom 0.305: R36.9 19.69,50.85 18.97,51.56 18.97,64.01 20.4,65.43 23.6,65.43 25.37,67.21 LED1.11
N$90
  Bottom 0.305: R36.10 20.93,47.83 20.93,51.03 21.64,51.74 21.64,62.94 23.42,64.72 25.37,64.72 27.86,67.21 LED1.10
N$91
  Bottom 0.305: R36.11 22.17,47.83 22.17,50.32 23.6,50.32 25.2,51.92 LED1.8
N$92  (via drill 0.61)
  Top 0.305: v24.13,49.25 23.06,50.32 20.22,50.32 20.22,51.92 LED1.6
  Bottom 0.305: v24.13,49.25 23.6,49.25 23.6,47.83 R36.12
N$93
  Bottom 0.305: R36.13 24.66,47.65 24.66,45.87 19.86,45.87 17.73,48.01 17.73,51.92 LED1.5
N$94  (via drill 0.61)
  Top 0.305: v26.09,46.23 29.64,49.78 29.64,60.1 23.24,66.5 23.24,66.67 23.06,66.85 23.06,67.21 LED1.12
  Bottom 0.305: v26.09,46.23 26.09,47.65 R36.14
N$95  (via drill 0.61)
  Top 0.305: v25.37,49.61 22.89,52.09 LED1.7
  Bottom 0.305: v25.37,49.61 27.33,49.61 27.33,47.83 R36.15
N$96
  Bottom 0.305: R36.16 28.58,51.56 28.4,51.56 28.04,51.92 27.86,51.92 LED1.9
N$97
  Bottom 0.305: U2.18 31.12,38.2 30.07,39.24 29.36,39.24 28.65,39.95 28.65,41.03 R36.1
N$98
  Bottom 0.305: U2.16 28.58,38.08 27.41,39.24 27.41,41 R36.2
N$99
  Bottom 0.305: U2.14 R36.3
N$100
  Bottom 0.305: U2.12 23.5,38.71 24.74,39.95 24.74,41.08 R36.4
N$101
  Bottom 0.305: U2.3 31.12,28.25 29.01,30.35 24.03,30.35 23.14,31.24 21.54,31.24 20.65,32.13 20.65,37.29 23.5,40.13 R36.5
N$102
  Bottom 0.305: U2.5 28.58,28.3 27.41,29.46 23.67,29.46 22.61,30.53 20.65,30.53 19.94,31.24 19.94,37.64 22.25,39.95 22.25,41.08 R36.6
N$103
  Bottom 0.305: U2.7 26.04,28.17 25.45,28.75 23.32,28.75 22.25,29.82 19.76,29.82 19.23,30.35 19.23,38 20.83,39.6 20.83,40.98 R36.7
N$104
  Bottom 0.305: U2.9 23.5,27.51 21.9,29.11 19.23,29.11 18.34,30 18.34,38.35 19.58,39.6 19.58,41 R36.8
N$105
  Top 0.305: CI.+ 48.49,5.16 J2.2
  Bottom 0.305: IC5.1 34.98,3.73 36.04,2.67 41.73,2.67 43.33,4.27 43.33,5.16 J2.2
N$107
  Top 0.305: 85.65,63.3 89.56,63.3 S2.2 | 85.65,63.3 83.16,63.3 S2.1 | R6.1 81.38,47.12 81.38,50.67 R3.1 81.56,50.67 81.56,53.7 82.45,54.59 D2.A 82.63,54.76 82.63,54.94 85.65,57.96 85.65,63.3
N$108  (via drill 0.6)
  other vias: 52.12,28.04
N$109  (via drill 0.6)
  other vias: 77.72,31.24
N$110
  Top 0.305: 99.7,63.3 103.43,63.3 S3.2 | 99.7,63.3 97.21,63.3 S3.1 | R7.1 95.25,47.12 95.07,47.3 95.07,50.49 95.25,50.67 R4.1 95.07,50.85 95.07,53.16 D3.A 96.67,54.76 96.67,54.94 99.7,57.96 99.7,63.3
N$111  (via drill 0.6, 0.61)
  Top 0.305: R5.2 75.59,48.87 75.59,51.69 76.2,52.3 D1.C 78.44,56.84 78.44,64.49 75.62,67.31 CSW1.+ | 89.83,40.98 90.45,40.36 90.45,1.96 70.36,1.96 67.34,4.98 X1.7 | 89.83,40.98 v82.63,48.18 | v89.92,41.25 89.92,41.07 89.83,40.98
  Bottom 0.305: v82.63,48.18 82.09,48.72 79.78,48.72 78,46.94 77.47,46.94 R5.2 | v89.92,41.25 TP7.TP
N$112  (via drill 0.6)
  Top 0.305: 97.83,40.8 106.45,32.18 106.45,9.07 98.63,1.25 67.87,1.25 65.2,3.91 65.2,4.62 64.85,4.98 X1.8 | 97.83,40.8 91.52,47.12 R6.2 | v97.74,40.54 97.74,40.72 97.83,40.8
  Bottom 0.305: R6.2 89.1,49.33 89.1,52.4 90.17,53.47 D2.C 91.95,56.39 91.95,65.02 89.66,67.31 CSW2.+ | v97.74,40.54 TP8.TP
N$113  (via drill 0.6)
  Top 0.305: v106.45,42.67 TP9.TP
  Bottom 0.305: CSW3.+ 103.35,67.31 105.64,65.02 105.64,56.11 D3.C 105.56,54.61 106.88,53.29 106.88,48.46 R7.2 105.56,46.94 106.45,46.94 v106.45,42.67 106.45,8.89 100.05,2.49 62.18,2.49 62.18,4.98 X1.9
N$114  (via drill 0.6)
  other vias: 68.3,22.53
N$115  (via drill 0.6)
  other vias: 69.72,22.53
N$116  (via drill 0.6)
  other vias: 68.94,37.34
N$117  (via drill 0.6)
  other vias: 72.39,22.53
N$118  (via drill 0.6)
  other vias: 78.97,31.24
N$119  (via drill 3.2)
  other vias: 2.87,2.97
N$120  (via drill 3.2)
  other vias: 105.28,2.62
N$121  (via drill 3.2)
  other vias: 105.11,71.96
N$122  (via drill 3.2)
  other vias: 2.87,71.96
N$123  (via drill 0.6)
  other vias: 73.81,34.24
N$124  (via drill 0.6)
  other vias: 52.65,42.44
N$125  (via drill 0.6)
  other vias: 80.21,31.24
N$127  (via drill 0.6 pad 0.25)
  other vias: 29.36,18.26
N$128  (via drill 0.6 pad 0.25)
  other vias: 33.63,18.26
N$129  (via drill 0.6)
  other vias: 81.46,31.24
N$130  (via drill 0.6)
  other vias: 53.9,42.44
N$131  (via drill 0.6 pad 0.25)
  other vias: 3.58,38.18
N$132  (via drill 0.6 pad 0.25)
  other vias: 5,38.71
N$133  (via drill 0.6 pad 0.25)
  other vias: 8.92,44.04
N$134  (via drill 0.6 pad 0.25)
  other vias: 10.34,42.8
N$135  (via drill 0.6)
  other vias: 56.57,34.44
N$137  (via drill 0.6)
  other vias: 65.46,28.57
VCC  (via drill 0.6, 0.61)
  Top 0.305: v68.94,37.34 68.94,37.87 69.29,38.23 | TP10.TP v28.4,3.91
  Bottom 0.305: U2.20 33.66,35.48 v33.2,35.03 33.02,34.85 | v17.02,35.03 17.02,36.63 U1.20 | v51.33,36.8 50.27,36.8 U3.20 | v58.27,20.45 57.56,20.45 IC1.14 | v76.4,18.14 73.74,20.8 IC2.14 | IC3.14 82.8,29.69 82.8,27.03 86,27.03 86.36,26.67 CI7.+ | IC4.14 82.63,41.07 85.65,38.05 86.54,38.05 CI8.+ | U4.20 68.38,36.78 v68.94,37.34 | v28.4,3.91 IC5.2
  pour Top: 2.08,67.92 7.95,67.92 7.95,72.9 100.05,72.9 100.05,66.5 105.74,66.5 105.74,8.18 99.7,8.18 99.7,1.96 9.19,1.96 9.19,8.36 2.08,8.36

### Text on the board
tPlace: Rev 1.4 | P13321-PCB-UICTE | User Interface Board | PCB Layout - Kevin Fronczak | Circuit Design - Holden Sandlar